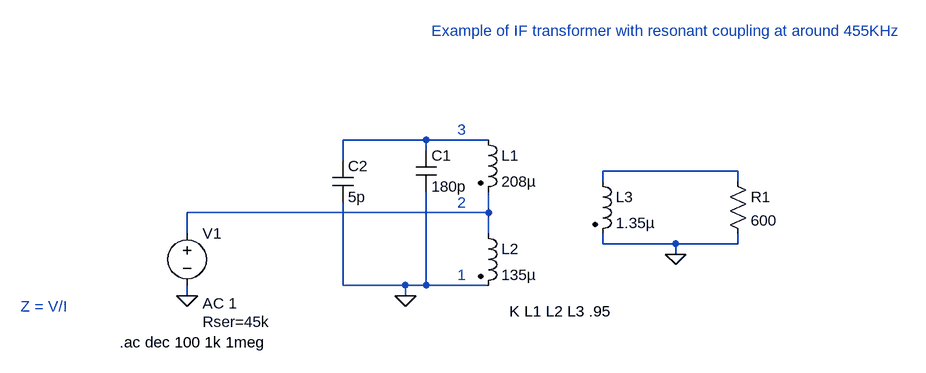
[diagram p0: schematic IF_Transformers.asc]
IF_Transformers.asc, the LTspice schematic file:
Version 4
SHEET 1 2036 1264
WIRE -224 832 -352 832
WIRE -128 832 -224 832
WIRE -224 848 -224 832
WIRE -352 864 -352 832
WIRE 256 880 48 880
WIRE 48 896 48 880
WIRE 256 896 256 880
WIRE -128 944 -128 912
WIRE -128 944 -592 944
WIRE -592 976 -592 944
WIRE -128 976 -128 944
WIRE 48 992 48 976
WIRE 160 992 48 992
WIRE 256 992 256 976
WIRE 256 992 160 992
WIRE 160 1008 160 992
WIRE -352 1056 -352 928
WIRE -256 1056 -352 1056
WIRE -224 1056 -224 912
WIRE -224 1056 -256 1056
WIRE -128 1056 -224 1056
WIRE -592 1072 -592 1056
WIRE -256 1072 -256 1056
FLAG -256 1072 0
FLAG 160 1008 0
FLAG -592 1072 0
SYMBOL ind2 -144 816 R0
SYMATTR InstName L1
SYMATTR Value 208µ
SYMATTR Type ind
SYMATTR SpiceLine Ipk=135u
SYMBOL ind2 -144 960 R0
SYMATTR InstName L2
SYMATTR Value 135µ
SYMATTR Type ind
SYMBOL ind2 32 880 R0
SYMATTR InstName L3
SYMATTR Value 1.35µ
SYMATTR Type ind
SYMBOL cap -240 848 R0
SYMATTR InstName C1
SYMATTR Value 180p
SYMBOL res 240 880 R0
SYMATTR InstName R1
SYMATTR Value 600
SYMBOL cap -368 864 R0
SYMATTR InstName C2
SYMATTR Value 5p
SYMBOL voltage -592 960 R0
WINDOW 123 24 124 Left 2
WINDOW 39 24 152 Left 2
SYMATTR Value2 AC 1
SYMATTR SpiceLine Rser=45k
SYMATTR InstName V1
SYMATTR Value ""
TEXT -216 664 Left 2 ;Example of IF transformer with resonant coupling at around 455KHz
TEXT -96 1096 Left 2 !K L1 L2 L3 .95
TEXT -176 1040 Left 2 ;1
TEXT -176 928 Left 2 ;2
TEXT -176 816 Left 2 ;3
TEXT -696 1144 Left 2 !.ac dec 100 1k 1meg
TEXT -848 1088 Left 2 ;Z = V/I

The netlist it stands for:
* IF_Transformers.asc
L1 N001 N003 208µ Ipk=135u
L2 N003 0 135µ
L3 N002 0 1.35µ
C1 N001 0 180p
R1 N002 0 600
C2 N001 0 5p
V1 N003 0 AC 1 Rser=45k
* Example of IF transformer with resonant coupling at around 455KHz
K L1 L2 L3 .95
* 1
* 2
* 3
.ac dec 100 1k 1meg
* Z = V/I
.backanno
.end